# Altium schematic sheet Guide_laser.SchDoc
size 420 x 297 mm; Address1: Address1; Address2: Address2; Address3: Address3; Address4: Address4; DocumentNumber: *Э3; SheetNumber: 6; SheetTotal: 10; DocumentType: Схема электрическая *
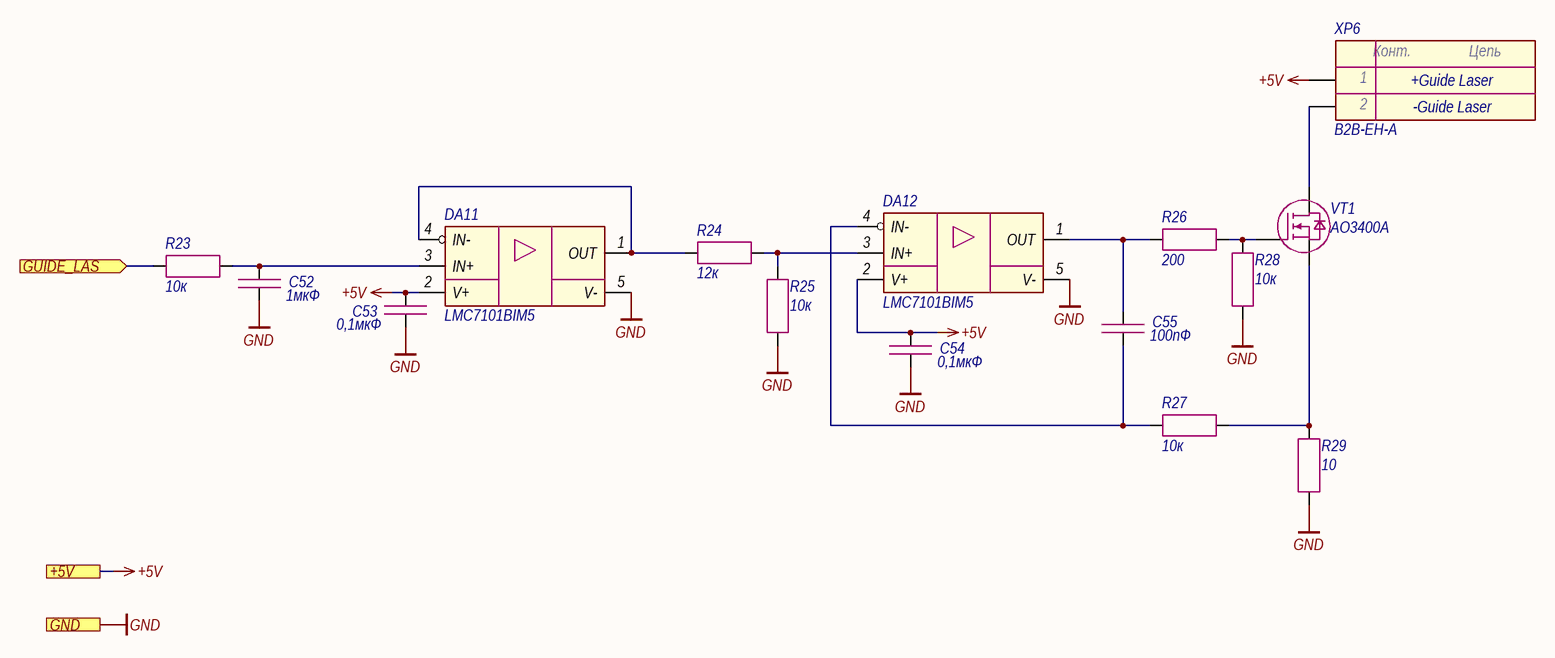
[diagram p0: Guide_laser.SchDoc]

## Parts
C52  1мкФ  [CAP_0603]
C53  0,1мкФ  [CAP_0603]
C54  0,1мкФ  [CAP_0603]
C55  100пФ  [CAP_0603]
DA11  LMC7101BIM5  [SOT-23-5]
DA12  LMC7101BIM5  [SOT-23-5]
R23  10к  [RES_0603]
R24  12к  [RES_0603]
R25  10к  [RES_0603]
R26  200  [RES_0603]
R27  10к  [RES_0603]
R28  10к  [RES_0603]
R29  10  [RES_1210]
VT1  AO3400A  [SOT-23-3]
XP6  B2B-EH-A  [B2B-EH-A]

## Ports
+5V (see Main[2A]), GND (see Main[2A], Ethernet[3D], Fiber_interlock[2C], Hardwiring[3D], Indication[1C], LD_driver[1D], Power_supply[1D]), GUIDE_LAS (in, see Main[2A])

## Nets
+5V: C53.1 C54.1 DA11.2(V+) DA12.2(V+) XP6.1 ; port +5V
GND: C52.2 C53.2 C54.2 DA11.5(V-) DA12.5(V-) R25.2 R28.1 R29.1 ; port GND
GUIDE_LAS: R23.1 ; port GUIDE_LAS
NetC52_1: C52.1 DA11.3(IN+) R23.2
NetC55_1: C55.1 DA12.1(OUT) R26.1
NetC55_2: C55.2 DA12.4(IN-) R27.1
NetDA11_1: DA11.1(OUT) DA11.4(IN-) R24.1
NetDA12_3: DA12.3(IN+) R24.2 R25.1
NetR26_2: R26.2 R28.2 VT1.1(G)
NetR27_2: R27.2 R29.2 VT1.2(S)
NetVT1_3: VT1.3(D) XP6.2

## Notes on the sheet
- +Guide Laser
- -Guide Laser
- Подп. и дата
- Инв. № дубл.
- Взам. инв. №
- Инв. № подл.
- Изм.
- Лист
- № докум.
- Подп.
- Дата
- Копировал
- Формат А3
- (in symbol Connector-2) Конт.; Цепь

## Library data of the parts
C52 = Capacitor: Manufacturer: Murata; Model: GRM188R61H105KAALD; Value: 1мкФ; Document: *
C53 C54 = Capacitor: Manufacturer: Murata; Model: GRM188R71H104KA93D; Value: 0,1мкФ; Document: *
C55 = Capacitor: Manufacturer: Murata; Model: GRM1885C1H101JA01D; Value: 100пФ; Document: *
DA11 DA12 = LMC7101: Manufacturer: Texas Instruments; Model: LMC7101BIM5; Document: *
R23 R25 R27 R28 = Resistor: Manufacturer: Yageo; Model: RC0603FR-0710KL; Value: 10к; Document: *
R24 = Resistor: Manufacturer: Yageo; Model: RC0603FR-0712KL; Value: 12к; Document: *
R26 = Resistor: Manufacturer: Yageo; Model: RC0603FR-07200RL; Value: 200; Document: *
R29 = Resistor: Manufacturer: Yageo; Model: RC1210FR-0710RL; Value: 10; Document: *
VT1 = MOSFET N-channel: Manufacturer: UMW; Model: AO3400A; Document: *
XP6 = Connector-2: Manufacturer: JST; Model: B2B-EH-A; Document: *